# EAGLE design Adafruit NeoPixel FeatherWing (EAGLE 6.4)
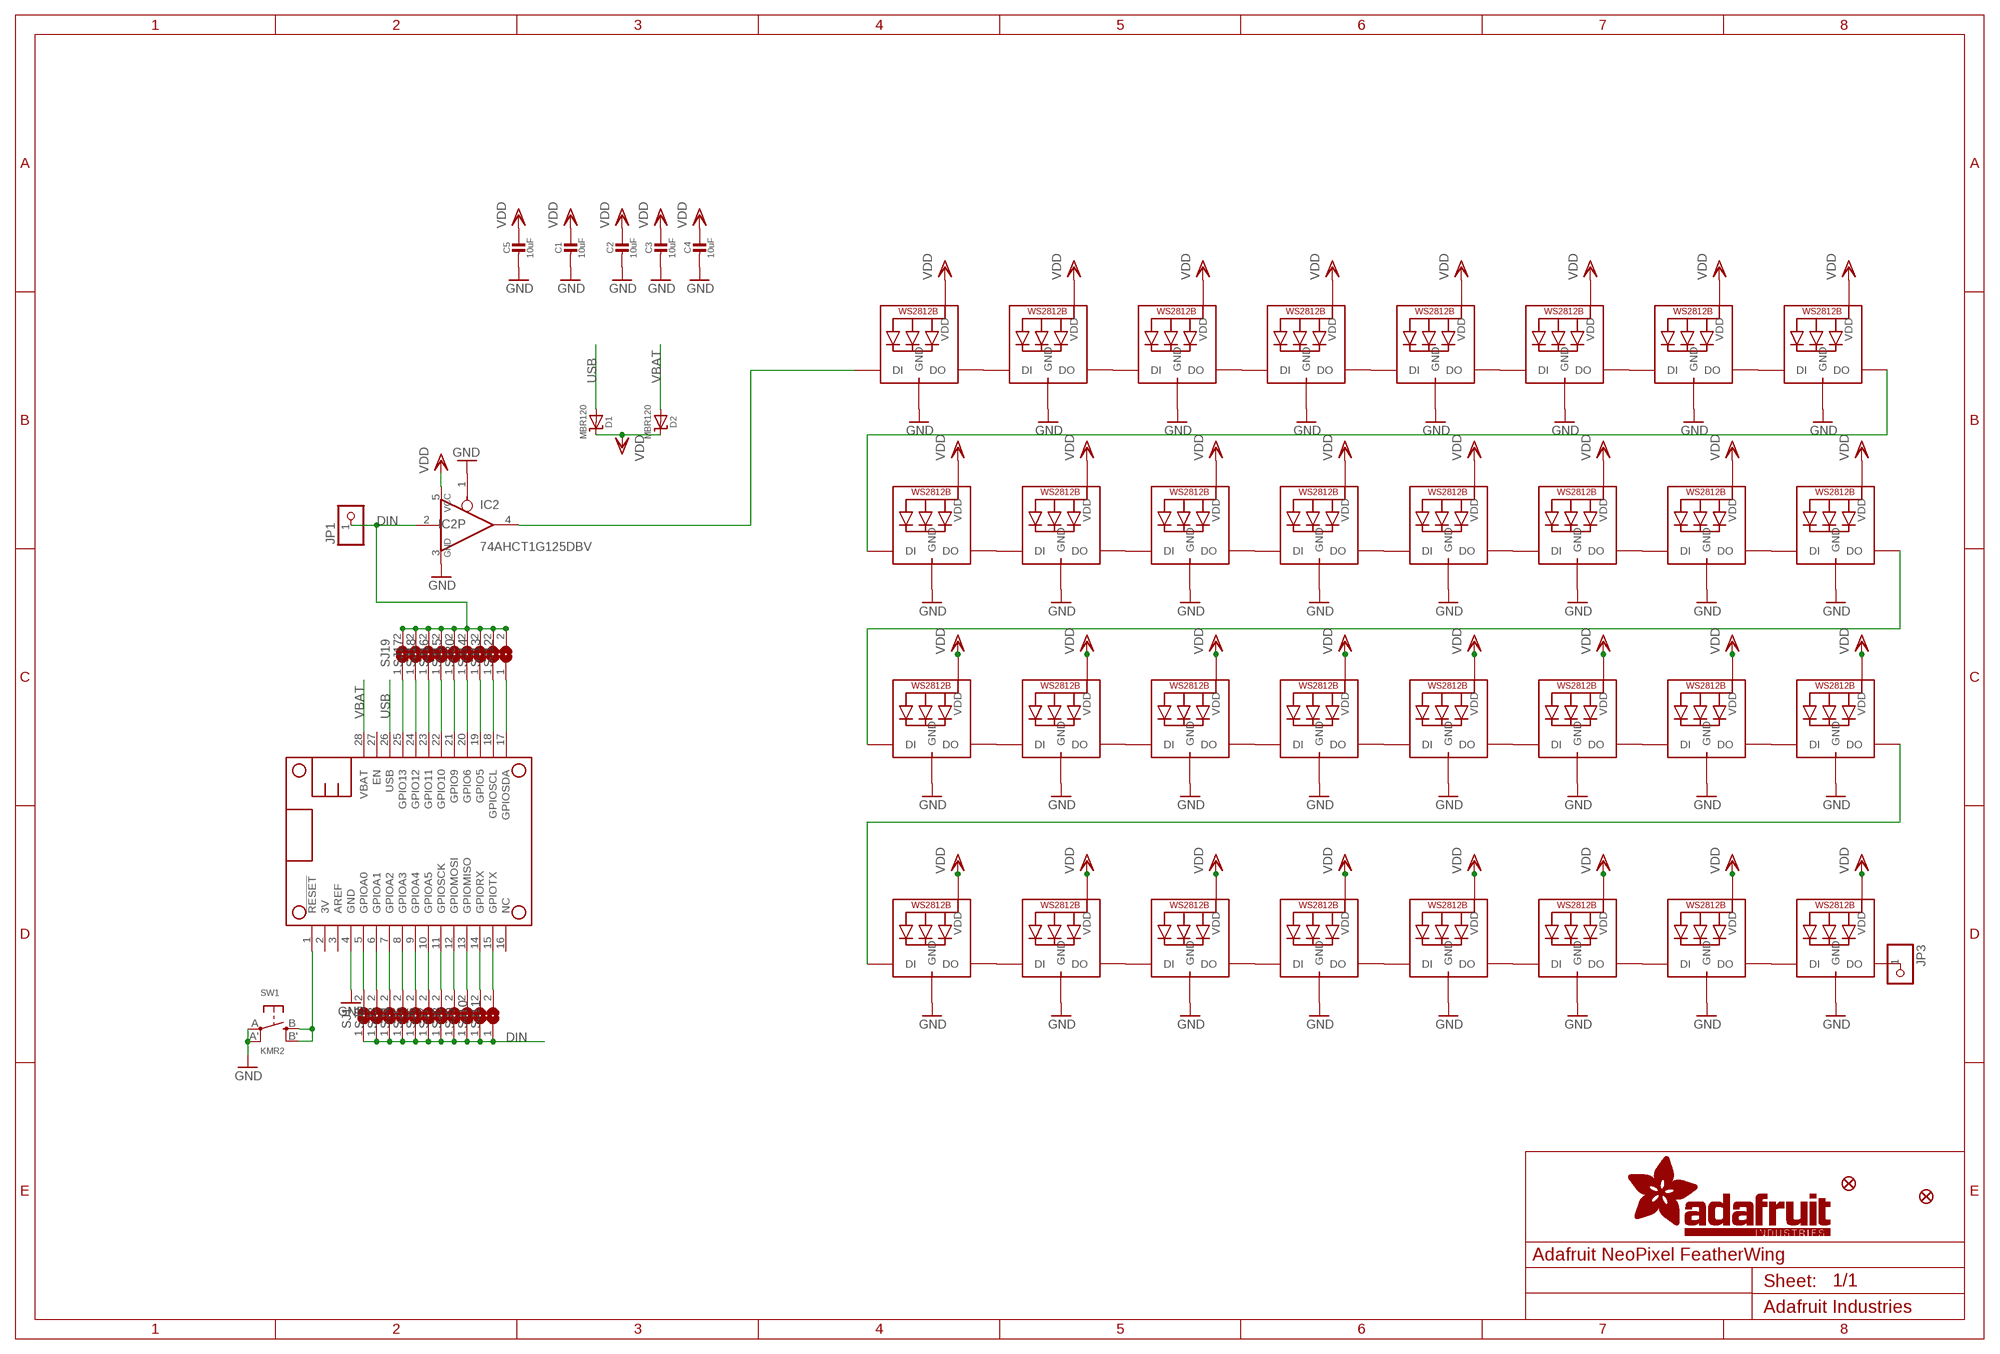
[diagram p0: schematic, sheet 1]

## Parts
C1  10uF  CAP_CERAMIC0805-NOOUTLINE  [0805-NO]
C2  10uF  CAP_CERAMIC0805-NOOUTLINE  [0805-NO]
C3  10uF  CAP_CERAMIC0805-NOOUTLINE  [0805-NO]
C4  10uF  CAP_CERAMIC0805-NOOUTLINE  [0805-NO]
C5  10uF  CAP_CERAMIC0805-NOOUTLINE  [0805-NO]
D1  MBR120  DIODE-SCHOTTKYSOD-123  [SOD-123]
D2  MBR120  DIODE-SCHOTTKYSOD-123  [SOD-123]
FID1  FIDUCIAL""  [FIDUCIAL_1MM]
FID3  FIDUCIAL""  [FIDUCIAL_1MM]
IC2  74AHCT1G125DBV  [SOT23-5]
JP1  HEADER-1X1ROUND  [1X01_ROUND]
JP3  HEADER-1X1ROUND  [1X01_ROUND]
LED1  WS2812B3535  [LED3535]
LED2  WS2812B3535  [LED3535]
LED3  WS2812B3535  [LED3535]
LED4  WS2812B3535  [LED3535]
LED5  WS2812B3535  [LED3535]
LED6  WS2812B3535  [LED3535]
LED7  WS2812B3535  [LED3535]
LED8  WS2812B3535  [LED3535]
LED9  WS2812B3535  [LED3535]
LED10  WS2812B3535  [LED3535]
LED11  WS2812B3535  [LED3535]
LED12  WS2812B3535  [LED3535]
LED13  WS2812B3535  [LED3535]
LED14  WS2812B3535  [LED3535]
LED15  WS2812B3535  [LED3535]
LED16  WS2812B3535  [LED3535]
LED17  WS2812B3535  [LED3535]
LED18  WS2812B3535  [LED3535]
LED19  WS2812B3535  [LED3535]
LED20  WS2812B3535  [LED3535]
LED21  WS2812B3535  [LED3535]
LED22  WS2812B3535  [LED3535]
LED23  WS2812B3535  [LED3535]
LED24  WS2812B3535  [LED3535]
LED25  WS2812B3535  [LED3535]
LED26  WS2812B3535  [LED3535]
LED27  WS2812B3535  [LED3535]
LED28  WS2812B3535  [LED3535]
LED29  WS2812B3535  [LED3535]
LED30  WS2812B3535  [LED3535]
LED31  WS2812B3535  [LED3535]
LED32  WS2812B3535  [LED3535]
MS1  FEATHERWING  [FEATHERWING]
SJ1  SOLDERJUMPER  [SOLDERJUMPER_ARROW_NOPASTE]
SJ2  SOLDERJUMPER  [SOLDERJUMPER_ARROW_NOPASTE]
SJ3  SOLDERJUMPER  [SOLDERJUMPER_ARROW_NOPASTE]
SJ4  SOLDERJUMPER  [SOLDERJUMPER_ARROW_NOPASTE]
SJ5  SOLDERJUMPER  [SOLDERJUMPER_ARROW_NOPASTE]
SJ6  SOLDERJUMPER  [SOLDERJUMPER_ARROW_NOPASTE]
SJ7  SOLDERJUMPER  [SOLDERJUMPER_ARROW_NOPASTE]
SJ8  SOLDERJUMPER  [SOLDERJUMPER_ARROW_NOPASTE]
SJ9  SOLDERJUMPER  [SOLDERJUMPER_ARROW_NOPASTE]
SJ10  SOLDERJUMPER  [SOLDERJUMPER_ARROW_NOPASTE]
SJ11  SOLDERJUMPER  [SOLDERJUMPER_ARROW_NOPASTE]
SJ12  SOLDERJUMPER  [SOLDERJUMPER_ARROW_NOPASTE]
SJ13  SOLDERJUMPER  [SOLDERJUMPER_ARROW_NOPASTE]
SJ14  SOLDERJUMPER  [SOLDERJUMPER_ARROW_NOPASTE]
SJ15  SOLDERJUMPER  [SOLDERJUMPER_ARROW_NOPASTE]
SJ16  SOLDERJUMPER  [SOLDERJUMPER_ARROW_NOPASTE]
SJ17  SOLDERJUMPER  [SOLDERJUMPER_ARROW_NOPASTE]
SJ18  SOLDERJUMPER  [SOLDERJUMPER_ARROW_NOPASTE]
SJ19  SOLDERJUMPER  [SOLDERJUMPER_ARROW_NOPASTE]
SJ20  SOLDERJUMPERCLOSED  [SOLDERJUMPER_CLOSEDWIRE]
SW1  KMR2  SWITCH_TACT_SMT4.6X2.8  [BTN_KMR2_4.6X2.8]

## Nets
D6: MS1.20(GPIO6) SJ20.1
DIN: IC2.2(I) JP1.1 SJ1.1 SJ2.1 SJ3.1 SJ4.1 SJ5.1 SJ6.1 SJ7.1 SJ8.1 SJ9.1 SJ10.1 SJ11.1 SJ12.2 SJ13.2 SJ14.2 SJ15.2 SJ16.2 SJ17.2 SJ18.2 SJ19.2 SJ20.2
GND: C1.2 C2.2 C3.2 C4.2 C5.2 IC2.1(OE) IC2.3(GND) LED1.4(GND) LED2.4(GND) LED3.4(GND) LED4.4(GND) LED5.4(GND) LED6.4(GND) LED7.4(GND) LED8.4(GND) LED9.4(GND) LED10.4(GND) LED11.4(GND) LED12.4(GND) LED13.4(GND) LED14.4(GND) LED15.4(GND) LED16.4(GND) LED17.4(GND) LED18.4(GND) LED19.4(GND) LED20.4(GND) LED21.4(GND) LED22.4(GND) LED23.4(GND) LED24.4(GND) LED25.4(GND) LED26.4(GND) LED27.4(GND) LED28.4(GND) LED29.4(GND) LED30.4(GND) LED31.4(GND) LED32.4(GND) MS1.4(GND) SW1.A'(P1) SW1.A(P)
N$1: LED19.3(DO) LED20.1(DI)
N$2: LED20.3(DO) LED21.1(DI)
N$3: MS1.25(GPIO13) SJ19.1
N$4: MS1.15(GPIOTX) SJ11.2
N$5: MS1.24(GPIO12) SJ17.1
N$6: MS1.14(GPIORX) SJ10.2
N$7: MS1.13(GPIOMISO) SJ9.2
N$8: MS1.12(GPIOMOSI) SJ8.2
N$9: MS1.11(GPIOSCK) SJ7.2
N$10: MS1.10(GPIOA5) SJ6.2
N$11: MS1.9(GPIOA4) SJ5.2
N$12: MS1.8(GPIOA3) SJ4.2
N$13: MS1.7(GPIOA2) SJ3.2
N$14: MS1.6(GPIOA1) SJ2.2
N$15: MS1.5(GPIOA0) SJ1.2
N$16: LED6.3(DO) LED25.1(DI)
N$17: LED21.3(DO) LED22.1(DI)
N$18: MS1.1(!RESET) SW1.B'(S1) SW1.B(S)
N$19: MS1.23(GPIO11) SJ18.1
N$20: MS1.22(GPIO10) SJ16.1
N$21: MS1.21(GPIO9) SJ15.1
N$22: IC2.4(O) LED1.1(DI)
N$23: MS1.19(GPIO5) SJ14.1
N$24: MS1.18(GPIOSCL) SJ13.1
N$25: MS1.17(GPIOSDA) SJ12.1
N$26: LED1.3(DO) LED2.1(DI)
N$27: LED2.3(DO) LED3.1(DI)
N$28: LED3.3(DO) LED4.1(DI)
N$29: LED4.3(DO) LED5.1(DI)
N$30: LED5.3(DO) LED6.1(DI)
N$31: LED7.3(DO) LED8.1(DI)
N$32: LED8.3(DO) LED9.1(DI)
N$33: LED9.3(DO) LED10.1(DI)
N$34: LED10.3(DO) LED11.1(DI)
N$35: LED11.3(DO) LED12.1(DI)
N$36: LED13.3(DO) LED14.1(DI)
N$37: LED14.3(DO) LED15.1(DI)
N$38: LED15.3(DO) LED16.1(DI)
N$39: LED16.3(DO) LED17.1(DI)
N$40: LED17.3(DO) LED18.1(DI)
N$41: LED12.3(DO) LED27.1(DI)
N$42: LED7.1(DI) LED26.3(DO)
N$43: LED22.3(DO) LED23.1(DI)
N$44: LED23.3(DO) LED24.1(DI)
N$45: LED19.1(DI) LED30.3(DO)
N$46: LED24.3(DO) LED31.1(DI)
N$47: LED25.3(DO) LED26.1(DI)
N$48: LED27.3(DO) LED28.1(DI)
N$49: LED18.3(DO) LED29.1(DI)
N$50: LED29.3(DO) LED30.1(DI)
N$51: LED31.3(DO) LED32.1(DI)
N$52: JP3.1 LED32.3(DO)
N$53: LED13.1(DI) LED28.3(DO)
USB: D1.A MS1.26(USB)
VBAT: D2.A MS1.28(VBAT)
VDD: C1.1 C2.1 C3.1 C4.1 C5.1 D1.C D2.C IC2.5(VCC) LED1.2(VDD) LED2.2(VDD) LED3.2(VDD) LED4.2(VDD) LED5.2(VDD) LED6.2(VDD) LED7.2(VDD) LED8.2(VDD) LED9.2(VDD) LED10.2(VDD) LED11.2(VDD) LED12.2(VDD) LED13.2(VDD) LED14.2(VDD) LED15.2(VDD) LED16.2(VDD) LED17.2(VDD) LED18.2(VDD) LED19.2(VDD) LED20.2(VDD) LED21.2(VDD) LED22.2(VDD) LED23.2(VDD) LED24.2(VDD) LED25.2(VDD) LED26.2(VDD) LED27.2(VDD) LED28.2(VDD) LED29.2(VDD) LED30.2(VDD) LED31.2(VDD) LED32.2(VDD)
Unconnected: MS1.2(3V) MS1.3(AREF) MS1.16(NC) MS1.27(EN)

## Library data of the parts
C1-C5 = microbuilder:CAP_CERAMIC: Ceramic Capacitors For new designs, use the packages preceded by an '_' character since they are more reliable: The following footprints should be used on most boards: _0402 - Standard footprint for regular board layouts _0603 - Standard footprint for regular board layouts _0805 - Standard footprint for regular board layouts _1206 - Standard footprint for regular board layouts For extremely tight-pitch boards where space is at a premium, the following 'micro-pitch' footprints can be used (smaller pads, no silkscreen outline, etc.): _0402MP - Micro-pitch footprint for very dense/compact boards _0603MP - Micro-pitch footprint for very dense/compact boards _0805MP - Micro-pitch footprint for very dense/compact boards _1206MP - Micro-pitch footprint for very dense/compact boards
D1 D2 = microbuilder:DIODE-SCHOTTKY
FID1 FID3 = microbuilder:FIDUCIAL: Fiducial Alignment Points Various fiducial points for machine vision alignment.; BOM: EXCLUDE
IC2 = 74xx-little-us:74*1G125: Single Bus Buffer Gate with 3-State Output
JP1 JP3 = microbuilder:HEADER-1X1: PIN HEADER
LED1-LED32 = microbuilder:WS2812B
MS1 = microbuilder:FEATHERWING
SJ1-SJ19 = microbuilder:SOLDERJUMPER: SMD Solder JUMPER Solder the two pads together to create a connection, or remove the solder to break it. REFLOW - Use this footprint for solder paste and reflow ovens. WAVE - Use this footprint for hand-soldering (larger pads). CLOSED - Has a trace between the two pads to ensure it is closed by default. The trace needs to be cut to disable the jumper, and can be closed again by creating a solder bridge between the two pads.; BOM: EXCLUDE
SJ20 = microbuilder:SOLDERJUMPER: SMD Solder JUMPER Solder the two pads together to create a connection, or remove the solder to break it. REFLOW - Use this footprint for solder paste and reflow ovens. WAVE - Use this footprint for hand-soldering (larger pads). CLOSED - Has a trace between the two pads to ensure it is closed by default. The trace needs to be cut to disable the jumper, and can be closed again by creating a solder bridge between the two pads.
SW1 = microbuilder:SWITCH_TACT_SMT: SMT Tact Switches 6x6mm - Digikey: P12940SCT-ND KMR2 (4.6x2.8mm) - Digikey: 401-1426-1-ND EVQ-PQHB55 - Light Touch, 160GF (4.5x4.5mm) - Digikey: P8090SCT-ND KMT0 - KMT021 NGJ LHS (etc.) IP68/Waterproof - Digikey: CKN10289CT-ND

## Board
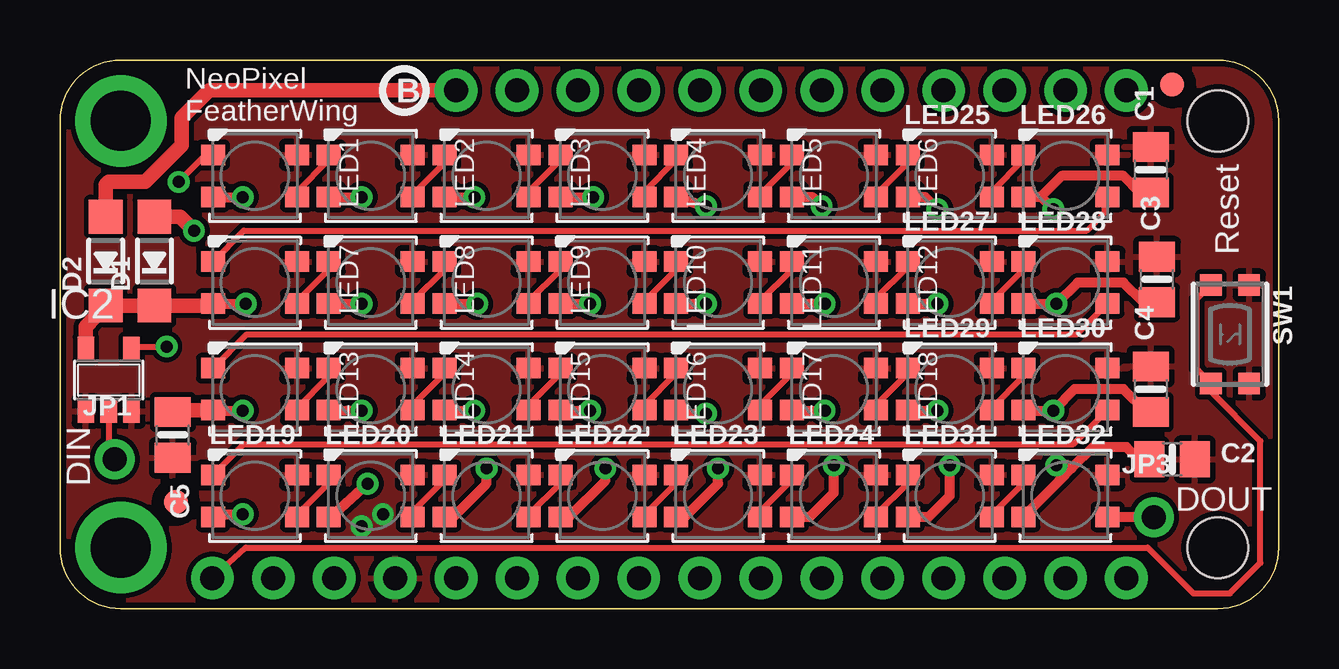
[diagram p1: board, top side]
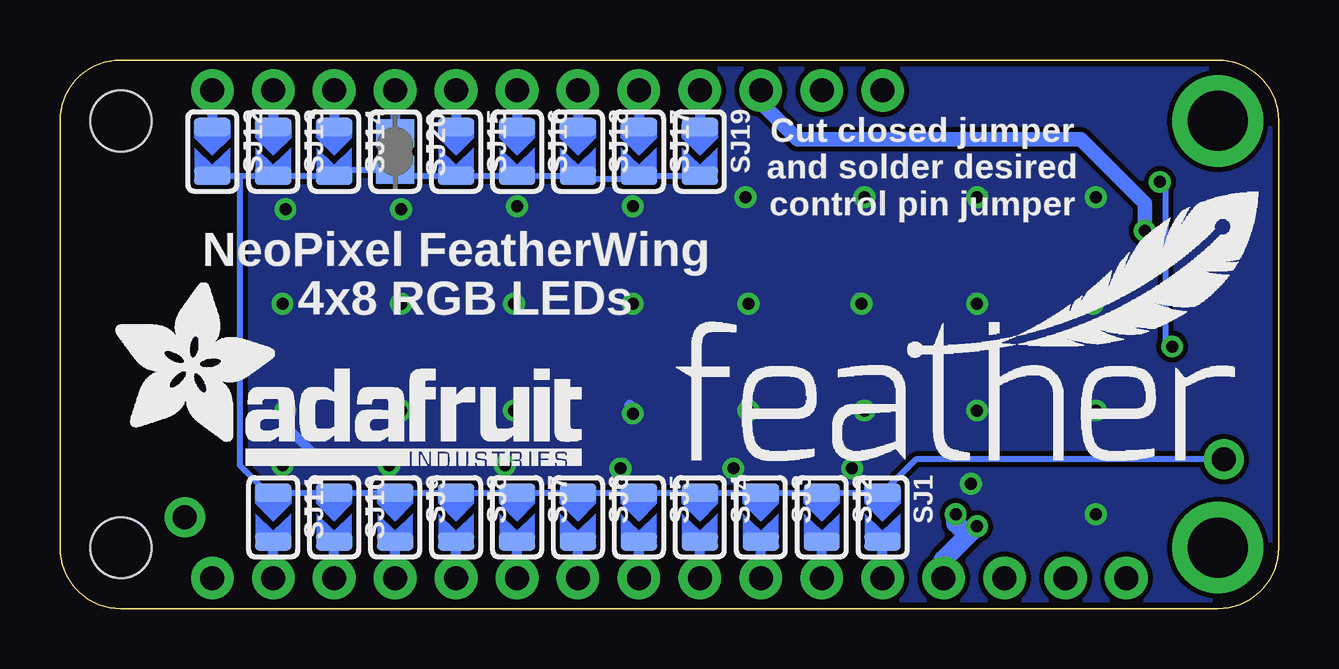
[diagram p2: board, bottom side, seen from below]

Size 50.8 x 22.86 mm. Coordinates in mm from the lower left corner, seen from the top.
Outline: 2.54,22.86 48.26,22.86 arc-90 50.8,20.32 50.8,2.54 arc-90 48.26,0 2.54,0 arc-90 0,2.54 0,20.32 arc-90 2.54,22.86
Copper layers (1*16): Top 0.035mm / dielectric 1.5mm / Bottom 0.035mm
Design rules "adafruit": minimum track width 8mil, minimum drill 15.5mil, track to track 8mil, track to pad 8mil, pad to pad 8mil, via to via 8mil, smd to smd 8mil, copper to edge 10mil, drill to drill 8mil, minimum pad ring 10mil, minimum via ring 8mil, stop-mask expansion 2mil, vias tented up to drill 20mil, thermal gap 10mil
bRestrict: area 17.5,3.2 to 18,3.3

### Footprints (pad centres in the part's own frame; a part is rotated, then mirrored left to right if it is on the bottom)
0805-NO = smd 1.24 x 1.5: 1 -0.95,0; 2 0.95,0
SOD-123 = smd 1.4 x 1.4: A 1.85,0; C -1.85,0
FIDUCIAL_1MM = smd 1 x 1: 1 0,0
SOT23-5 = smd 0.69 x 0.99: 1 -0.95,-1.29; 2 0,-1.29; 3 0.95,-1.29; 4 0.95,1.3; 5 -0.95,1.3
1X01_ROUND = drill 1 pad 1.676: 1 0,0
LED3535 = smd 1 x 0.85: 1 -1.75,0.875; 2 -1.75,-0.875; 3 1.75,-0.875; 4 1.75,0.875
FEATHERWING = drill 1 pad 1.778: 1 6.35,1.27; 2 8.89,1.27; 3 11.43,1.27; 4 13.97,1.27; 5 16.51,1.27; 6 19.05,1.27; 7 21.59,1.27; 8 24.13,1.27; 9 26.67,1.27; 10 29.21,1.27; 11 31.75,1.27; 12 34.29,1.27; 13 36.83,1.27; 14 39.37,1.27; 15 41.91,1.27; 16 44.45,1.27; 17 44.45,21.59; 18 41.91,21.59; 19 39.37,21.59; 20 36.83,21.59; 21 34.29,21.59; 22 31.75,21.59; 23 29.21,21.59; 24 26.67,21.59; 25 24.13,21.59; 26 21.59,21.59; 27 19.05,21.59; 28 16.51,21.59 | drill 2.5 pad 3.81: P$1 2.54,20.32; P$2 2.54,2.54 | hole 2.54: 48.26,20.32; 48.26,2.54
SOLDERJUMPER_ARROW_NOPASTE = smd 0.762 x 1.524: 1 -1.016,0; 2 1.016,0
SOLDERJUMPER_CLOSEDWIRE = smd 1.168 x 1.6: 1 -0.762,0; 2 0.762,0 | smd 0.635 x 0.203: WIRE 0,0
BTN_KMR2_4.6X2.8 = smd 0.9 x 0.9: A 2.05,0.8; A' -2.05,0.8; B 2.05,-0.8; B' -2.05,-0.8

### Placement (x,y rotation side)
C1  45.47,18.29 90 top
C2  46.35,6.22 0 top
C3  45.72,13.72 90 top
C4  45.47,9.14 90 top
C5  4.7,7.24 270 top
D1  3.94,14.48 90 top
D2  1.91,14.48 90 top
FID1  46.35,21.84 0 top
FID3  4.83,4.45 0 top
IC2  2.03,9.53 0 top
JP1  2.29,6.22 0 top
JP3  45.59,3.81 0 top
LED1  8.13,18.03 0 top
LED2  12.95,18.03 0 top
LED3  17.78,18.03 0 top
LED4  22.61,18.03 0 top
LED5  27.43,18.03 0 top
LED6  32.26,18.03 0 top
LED7  8.13,13.59 0 top
LED8  12.95,13.59 0 top
LED9  17.78,13.59 0 top
LED10  22.61,13.59 0 top
LED11  27.43,13.59 0 top
LED12  32.26,13.59 0 top
LED13  8.13,9.14 0 top
LED14  12.95,9.14 0 top
LED15  17.78,9.14 0 top
LED16  22.61,9.14 0 top
LED17  27.43,9.14 0 top
LED18  32.26,9.14 0 top
LED19  8.13,4.7 0 top
LED20  12.95,4.7 0 top
LED21  17.78,4.7 0 top
LED22  22.61,4.7 0 top
LED23  27.43,4.7 0 top
LED24  32.26,4.7 0 top
LED25  37.08,18.03 0 top
LED26  41.91,18.03 0 top
LED27  37.08,13.59 0 top
LED28  41.91,13.59 0 top
LED29  37.08,9.14 0 top
LED30  41.91,9.14 0 top
LED31  37.08,4.7 0 top
LED32  41.91,4.7 0 top
MS1  0,0 0 top
SJ1  16.51,3.81 270 bottom
SJ2  19.05,3.81 270 bottom
SJ3  21.59,3.81 270 bottom
SJ4  24.13,3.81 270 bottom
SJ5  26.67,3.81 270 bottom
SJ6  29.21,3.81 270 bottom
SJ7  31.75,3.81 270 bottom
SJ8  34.29,3.81 270 bottom
SJ9  36.83,3.81 270 bottom
SJ10  39.37,3.81 270 bottom
SJ11  41.91,3.81 270 bottom
SJ12  44.45,19.05 270 bottom
SJ13  41.91,19.05 270 bottom
SJ14  39.37,19.05 270 bottom
SJ15  34.29,19.05 270 bottom
SJ16  31.75,19.05 270 bottom
SJ17  26.67,19.05 270 bottom
SJ18  29.21,19.05 270 bottom
SJ19  24.13,19.05 270 bottom
SJ20  36.83,19.05 270 bottom
SW1  48.77,11.43 270 top
U$2  [PCBFEAT-REV-040]  14.35,21.59 0 top
U$3  [FEATHERLOGO]  25.15,6.1 0 bottom
U$4  [ADAFRUIT_TEXT_20MM]  48.64,5.97 0 bottom

### Tracks (layer width: path | path; a pad name or v marks a point on that pad's centre or on a via)
D6
  Bottom 0.406: MS1.20 SJ20.1
DIN
  Top 0.254: IC2.2 2.03,6.22 JP1.1
  Bottom 0.254: JP1.1 15.11,6.22 SJ1.1 SJ2.1 SJ3.1 SJ4.1 SJ5.1 SJ6.1 SJ7.1 SJ8.1 SJ9.1 SJ10.1 SJ11.1 42.16,4.83 43.31,5.97 43.31,18.03 SJ12.2 SJ13.2 SJ14.2 39.12,18.29 SJ20.2 36.58,18.03 SJ15.2 SJ16.2 SJ18.2 29.08,17.91 26.16,17.91 26.29,18.03 SJ17.2 SJ19.2
GND  (via drill 0.5)
  Bottom 0.813: MS1.4 13.97,2.03 v12.57,3.43 | v13.46,3.94 13.46,3.56 13.08,3.17
  pour Top: 0,22.86 0,0 50.8,0 50.8,22.86
N$1
  Top 0.254: LED19.3 9.88,3.91 11.2,5.24 LED20.1
N$2
  Top 0.254: LED20.3 14.7,4.04 16.03,5.36 LED21.1
N$3
  Bottom 0.406: MS1.25 SJ19.1
N$4
  Bottom 0.406: MS1.15 SJ11.2
N$5
  Bottom 0.406: MS1.24 SJ17.1
N$6
  Bottom 0.406: MS1.14 SJ10.2
N$7
  Bottom 0.406: MS1.13 SJ9.2
N$8
  Bottom 0.406: MS1.12 SJ8.2
N$9
  Bottom 0.406: MS1.11 SJ7.2
N$10
  Bottom 0.406: MS1.10 SJ6.2
N$11
  Bottom 0.406: MS1.9 SJ5.2
N$12
  Bottom 0.406: MS1.8 SJ4.2
N$13
  Bottom 0.406: MS1.7 SJ3.2
N$14
  Bottom 0.406: MS1.6 SJ2.2
N$15
  Bottom 0.406: MS1.5 SJ1.2
N$16
  Top 0.254: LED6.3 34.01,17.24 35.33,18.57 LED25.1
N$17
  Top 0.254: LED21.3 19.53,3.91 20.86,5.24 LED22.1
N$18
  Top 0.254: SW1.B' 47.37,12.88 47.37,10.03 SW1.B 47.97,9.05 50.04,6.99 50.04,1.91 48.77,0.64 47.24,0.64 45.34,2.54 7.75,2.54 MS1.1
N$19
  Bottom 0.406: MS1.23 SJ18.1
N$20
  Bottom 0.406: MS1.22 SJ16.1
N$21
  Bottom 0.406: MS1.21 SJ15.1
N$22  (via drill 0.5)
  Top 0.254: IC2.4 3.08,10.92 v4.45,10.92 | v4.95,17.78 6.08,18.91 LED1.1
  Bottom 0.254: v4.45,10.92 4.7,11.18 4.7,17.53 v4.95,17.78
N$23
  Bottom 0.406: MS1.19 SJ14.1
N$24
  Bottom 0.406: MS1.18 SJ13.1
N$25
  Bottom 0.406: MS1.17 SJ12.1
N$26
  Top 0.254: LED1.3 9.88,17.37 11.2,18.7 LED2.1
N$27
  Top 0.254: LED2.3 14.7,17.24 16.03,18.57 LED3.1
N$28
  Top 0.254: LED3.3 19.53,17.37 20.86,18.7 LED4.1
N$29
  Top 0.254: LED4.3 24.36,17.37 25.68,18.7 LED5.1
N$30
  Top 0.254: LED5.3 29.18,17.24 30.51,18.57 LED6.1
N$31
  Top 0.254: LED7.3 9.88,12.8 11.2,14.12 LED8.1
N$32
  Top 0.254: LED8.3 14.7,12.8 16.03,14.12 LED9.1
N$33
  Top 0.254: LED9.3 19.53,12.8 20.86,14.12 LED10.1
N$34
  Top 0.254: LED10.3 24.36,12.8 25.68,14.12 LED11.1
N$35
  Top 0.254: LED11.3 29.18,12.8 30.51,14.12 LED12.1
N$36
  Top 0.254: LED13.3 9.88,8.35 11.2,9.68 LED14.1
N$37
  Top 0.254: LED14.3 14.7,8.48 16.03,9.81 LED15.1
N$38
  Top 0.254: LED15.3 19.53,8.48 20.86,9.81 LED16.1
N$39
  Top 0.254: LED16.3 24.36,8.48 25.68,9.81 LED17.1
N$40
  Top 0.254: LED17.3 29.18,8.48 30.51,9.81 LED18.1
N$41
  Top 0.254: LED12.3 34.01,12.93 35.33,14.25 LED27.1
N$42
  Top 0.254: LED7.1 7.66,15.75 42.8,15.75 43.56,16.51 43.56,17.06 LED26.3
N$43
  Top 0.254: LED22.3 24.36,3.91 25.68,5.24 LED23.1
N$44
  Top 0.254: LED23.3 29.18,4.04 30.51,5.36 LED24.1
N$45
  Top 0.254: LED19.1 7.66,6.86 42.25,6.86 LED30.3
N$46
  Top 0.254: LED24.3 34.01,3.91 35.33,5.24 LED31.1
N$47
  Top 0.254: LED25.3 38.83,17.37 40.16,18.7 LED26.1
N$48
  Top 0.254: LED27.3 38.83,12.8 40.16,14.12 LED28.1
N$49
  Top 0.254: LED18.3 34.01,8.48 35.33,9.81 LED29.1
N$50
  Top 0.254: LED29.3 38.83,8.35 40.16,9.68 LED30.1
N$51
  Top 0.254: LED31.3 38.83,3.91 40.16,5.24 LED32.1
N$52
  Top 0.406: LED32.3 45.58,3.82 JP3.1
N$53
  Top 0.254: LED13.1 7.79,11.43 42.38,11.43 LED28.3
USB  (via drill 0.5)
  Top 0.61: v5.59,15.75 5.01,16.33 D1.A
  Bottom 0.61: MS1.26 21.59,21.08 20.07,19.56 8.26,19.56 5.59,16.89 v5.59,15.75
VBAT
  Top 0.61: MS1.28 6.22,21.59 5.08,20.45 5.08,19.3 3.56,17.78 2.03,17.78 1.91,17.65 D2.A
VDD  (via drill 0.5)
  Top 0.406: LED1.2 6.39,17.14 v7.62,17.14 | LED2.2 11.6,17.14 v12.57,17.14 | LED3.2 16.04,17.14 v17.27,17.14 | LED4.2 20.87,17.14 v22.23,17.14 | LED5.2 25.7,17.14 v26.92,16.76 | LED6.2 31.36,17.16 v31.75,16.76 | LED25.2 36.05,17.16 v36.58,16.64 | LED26.2 40.88,17.16 | 40.88,17.16 v41.4,16.64 | LED28.2 40.17,12.7 v41.53,12.7 42.42,13.59 44.32,13.59 45.15,12.77 C3.1 | LED27.2 35.35,12.7 v36.58,12.7 | LED12.2 30.52,12.7 v31.88,12.7 | LED11.2 25.7,12.7 v26.92,12.7 | LED10.2 v22.1,12.7 | LED9.2 16.04,12.7 v17.4,12.7 | LED8.2 11.22,12.7 v12.57,12.7 | LED7.2 6.39,12.7 v7.75,12.7 | LED13.2 6.39,8.26 v7.62,8.26 | LED19.2 6.49,3.94 v7.62,3.94 | LED14.2 11.98,8.26 v12.57,8.26 | LED15.2 16.04,8.26 v17.27,8.26 | LED16.2 20.87,8.26 v22.1,8.26 | LED17.2 25.7,8.13 v26.92,8.13 | LED18.2 30.52,8.26 v31.88,8.26 | LED29.2 35.35,8.26 v36.58,8.26 | LED30.2 40.17,8.26 v41.4,8.26 42.29,9.14 44.32,9.14 45.27,8.19 C4.1 | C1.1 45.02,17.34 44.32,18.03 41.76,18.03 40.88,17.16 | C2.1 44.96,6.22 44.45,6.73 43.05,6.73 42.16,5.84 | 42.16,5.84 41.66,5.33 41.66,5.32 LED32.2 | LED20.2 11.44,3.95 v12.83,5.21 | LED21.2 16.4,3.82 17.78,5.21 v17.78,5.84 | LED22.2 21.22,3.82 22.73,5.33 v22.73,5.84 | LED23.2 26.05,3.82 27.43,5.21 v27.43,5.84 | LED24.2 31.26,3.82 32.26,4.83 v32.26,5.97 | LED31.2 36.21,3.82 37.08,4.7 v37.08,5.97 | 42.16,5.84 42.04,5.97 v41.53,5.97
  Top 0.61: IC2.5 1.08,11.74 D2.C D1.C 6.38,12.63 LED7.2 | C5.1 4.78,8.27 LED13.2
  Bottom 0.406: v7.62,17.14 7.87,17.14 | v12.57,17.14 12.32,17.27 12.7,17.14 | v17.27,17.14 17.14,17.27 | v22.23,17.14 22.35,17.27 22.23,17.27 | v26.92,16.76 26.8,16.89 26.92,16.89 | v31.75,16.76 31.62,16.76 | v36.58,16.64 36.58,16.38 | v41.4,16.64 41.27,16.51 41.4,16.38 | v41.53,12.7 41.53,12.95 | v36.58,12.7 36.7,12.83 36.83,12.83 | v31.88,12.7 31.75,12.83 31.75,12.95 | v26.92,12.7 27.05,12.7 | v22.1,12.7 22.23,12.83 | v17.4,12.7 17.53,12.83 17.53,12.95 | v12.57,12.7 12.7,12.83 12.7,12.95 | v7.75,12.7 8,12.7 | v7.62,8.26 7.87,8.26 | v7.62,3.94 7.75,3.81 7.87,3.81 | v17.27,8.26 17.14,8.38 17.4,8.38 | v22.1,8.26 22.23,8.51 | v26.92,8.13 27.05,8.26 27.05,8.51 | v31.88,8.26 32,8.38 | v36.58,8.26 36.83,8.51 | v41.4,8.26 41.53,8.38 | v17.78,5.84 17.78,5.97 17.65,6.1 | v22.73,5.84 22.48,5.84 | v27.43,5.84 27.43,5.97 27.3,6.1 | v32.26,5.97 32.13,5.97 | v37.08,5.97 37.08,6.1 | 41.27,8.26 41.27,7.49 40.01,6.22 37.59,6.22 37.21,5.84 | v41.53,5.97 41.4,5.97
  pour Bottom: 0,22.86 0,0 50.8,0 50.8,22.86

### Text on the board
tPlace: NeoPixel / FeatherWing | Reset | DIN | DOUT
bPlace: Cut closed jumper / and solder desired / control pin jumper | NeoPixel FeatherWing | 4x8 RGB LEDs